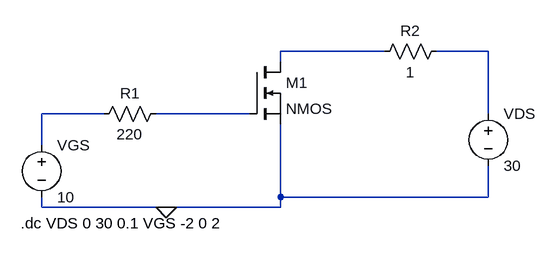
[diagram p0: schematic nmos_caracteristic.asc]
nmos_caracteristic.asc, the LTspice schematic file:
Version 4
SHEET 1 880 680
WIRE 400 32 240 32
WIRE 560 32 480 32
WIRE 240 48 240 32
WIRE -32 128 -128 128
WIRE 192 128 48 128
WIRE 560 128 560 32
WIRE -128 176 -128 128
WIRE 240 256 240 144
WIRE 560 256 560 208
WIRE 560 256 240 256
WIRE -128 272 -128 256
WIRE 64 272 -128 272
WIRE 240 272 240 256
WIRE 240 272 64 272
FLAG 64 272 0
SYMBOL voltage -128 160 R0
WINDOW 123 0 0 Left 0
WINDOW 39 0 0 Left 0
SYMATTR InstName VGS
SYMATTR Value 10
SYMBOL voltage 560 112 R0
WINDOW 123 0 0 Left 0
WINDOW 39 0 0 Left 0
SYMATTR InstName VDS
SYMATTR Value 30
SYMBOL res 64 112 R90
WINDOW 0 0 56 VBottom 2
WINDOW 3 32 56 VTop 2
SYMATTR InstName R1
SYMATTR Value 220
SYMBOL res 496 16 R90
WINDOW 0 0 56 VBottom 2
WINDOW 3 32 56 VTop 2
SYMATTR InstName R2
SYMATTR Value 1
SYMBOL nmos 192 48 R0
SYMATTR InstName M1
TEXT -160 296 Left 2 !.dc VDS 0 30 0.1 VGS -2 0 2

The netlist it stands for:
* nmos_caracteristic.asc
VGS N003 0 10
VDS N002 0 30
R1 N004 N003 220
R2 N002 N001 1
M1 N001 N004 0 0 NMOS
.model NMOS NMOS
.model PMOS PMOS
.lib standard.mos
.dc VDS 0 30 0.1 VGS -2 0 2
.backanno
.end